# EAGLE design kitteh (EAGLE 5.11)
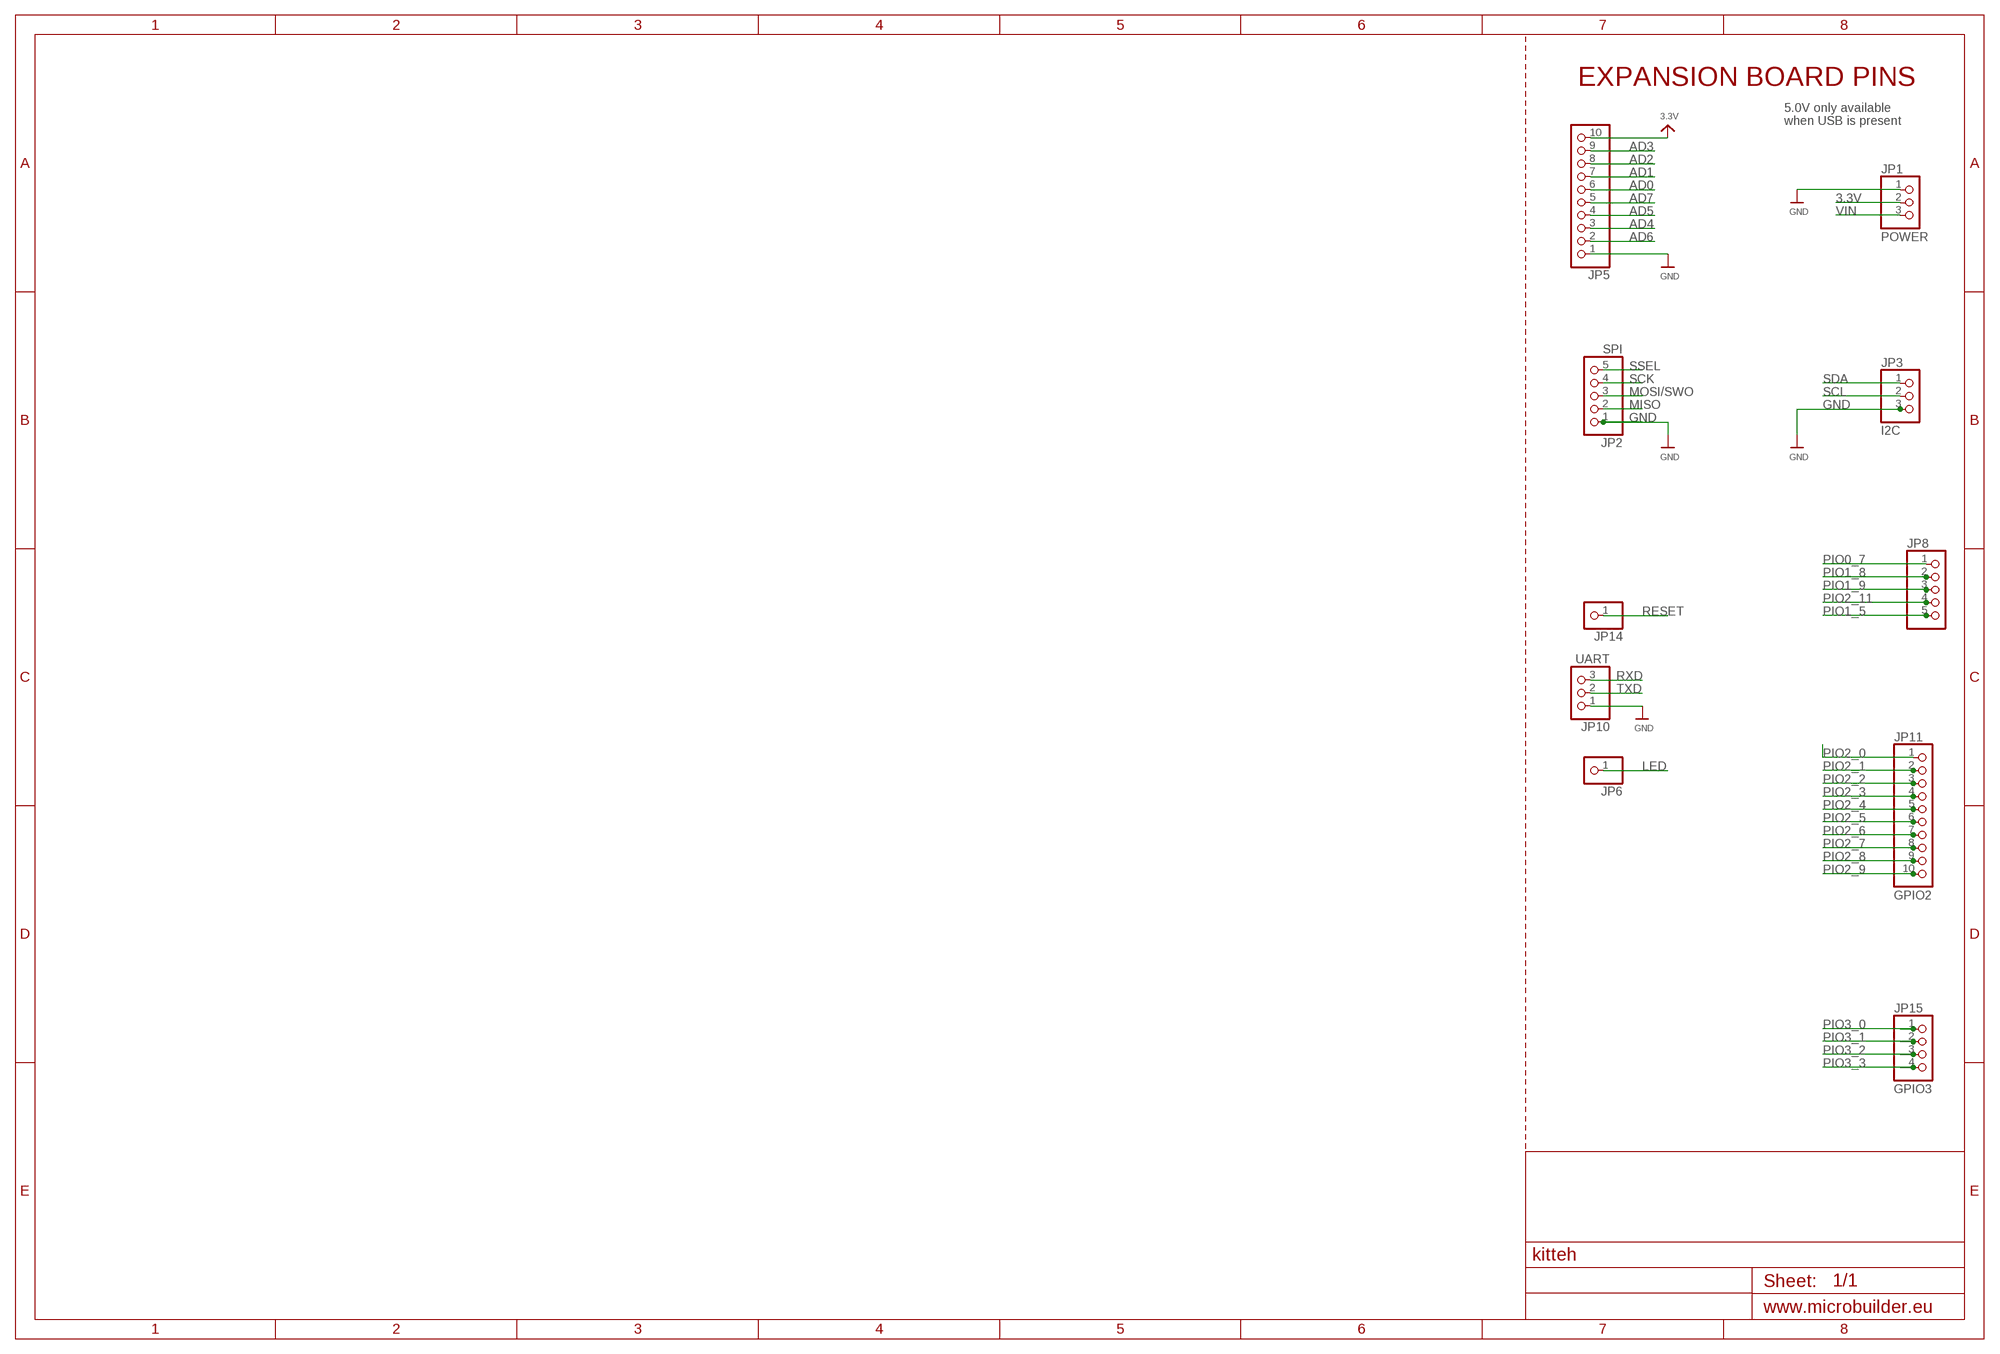
[diagram p0: schematic, sheet 1]

## Parts
JP1  POWER  HEADER-1X3  [1X03_OVAL]
JP2  SPI  HEADER-1X5  [1X05_OVAL]
JP3  I2C  HEADER-1X3  [1X03_OVAL]
JP5  HEADER-1X10  [1X10_OVAL]
JP6  HEADER-1X1  [1X01_OVAL]
JP8  HEADER-1X5  [1X05_OVAL]
JP10  UART  HEADER-1X3  [1X03_OVAL]
JP11  GPIO2  HEADER-1X10  [1X10_OVAL]
JP14  HEADER-1X1  [1X01_OVAL]
JP15  GPIO3  HEADER-1X4  [1X04_OVAL]

## Nets
3.3V: JP1.2 JP5.10
AD0: JP5.6
AD1: JP5.7
AD2: JP5.8
AD3: JP5.9
AD4: JP5.3
AD5: JP5.4
AD6: JP5.2
AD7: JP5.5
GND: JP1.1 JP2.1 JP3.3 JP5.1 JP10.1
LED: JP6.1
MISO: JP2.2
MOSI/SWO: JP2.3
PIO0_7: JP8.1
PIO1_5: JP8.5
PIO1_8: JP8.2
PIO1_9: JP8.3
PIO2_0: JP11.1
PIO2_1: JP11.2
PIO2_2: JP11.3
PIO2_3: JP11.4
PIO2_4: JP11.5
PIO2_5: JP11.6
PIO2_6: JP11.7
PIO2_7: JP11.8
PIO2_8: JP11.9
PIO2_9: JP11.10
PIO2_11: JP8.4
PIO3_0: JP15.1
PIO3_1: JP15.2
PIO3_2: JP15.3
PIO3_3: JP15.4
RESET: JP14.1
RXD: JP10.3
SCK: JP2.4
SCL: JP3.2
SDA: JP3.1
SSEL: JP2.5
TXD: JP10.2
VIN: JP1.3

## Notes on the sheet
- EXPANSION BOARD PINS
- 5.0V only available
- when USB is present

## Library data of the parts
JP1 JP3 JP10 = microbuilder:HEADER-1X3: PIN HEADER
JP2 JP8 = microbuilder:HEADER-1X5: PIN HEADER
JP5 JP11 = microbuilder:HEADER-1X10: PIN HEADER
JP6 JP14 = microbuilder:HEADER-1X1: PIN HEADER
JP15 = microbuilder:HEADER-1X4: PIN HEADER

## Board
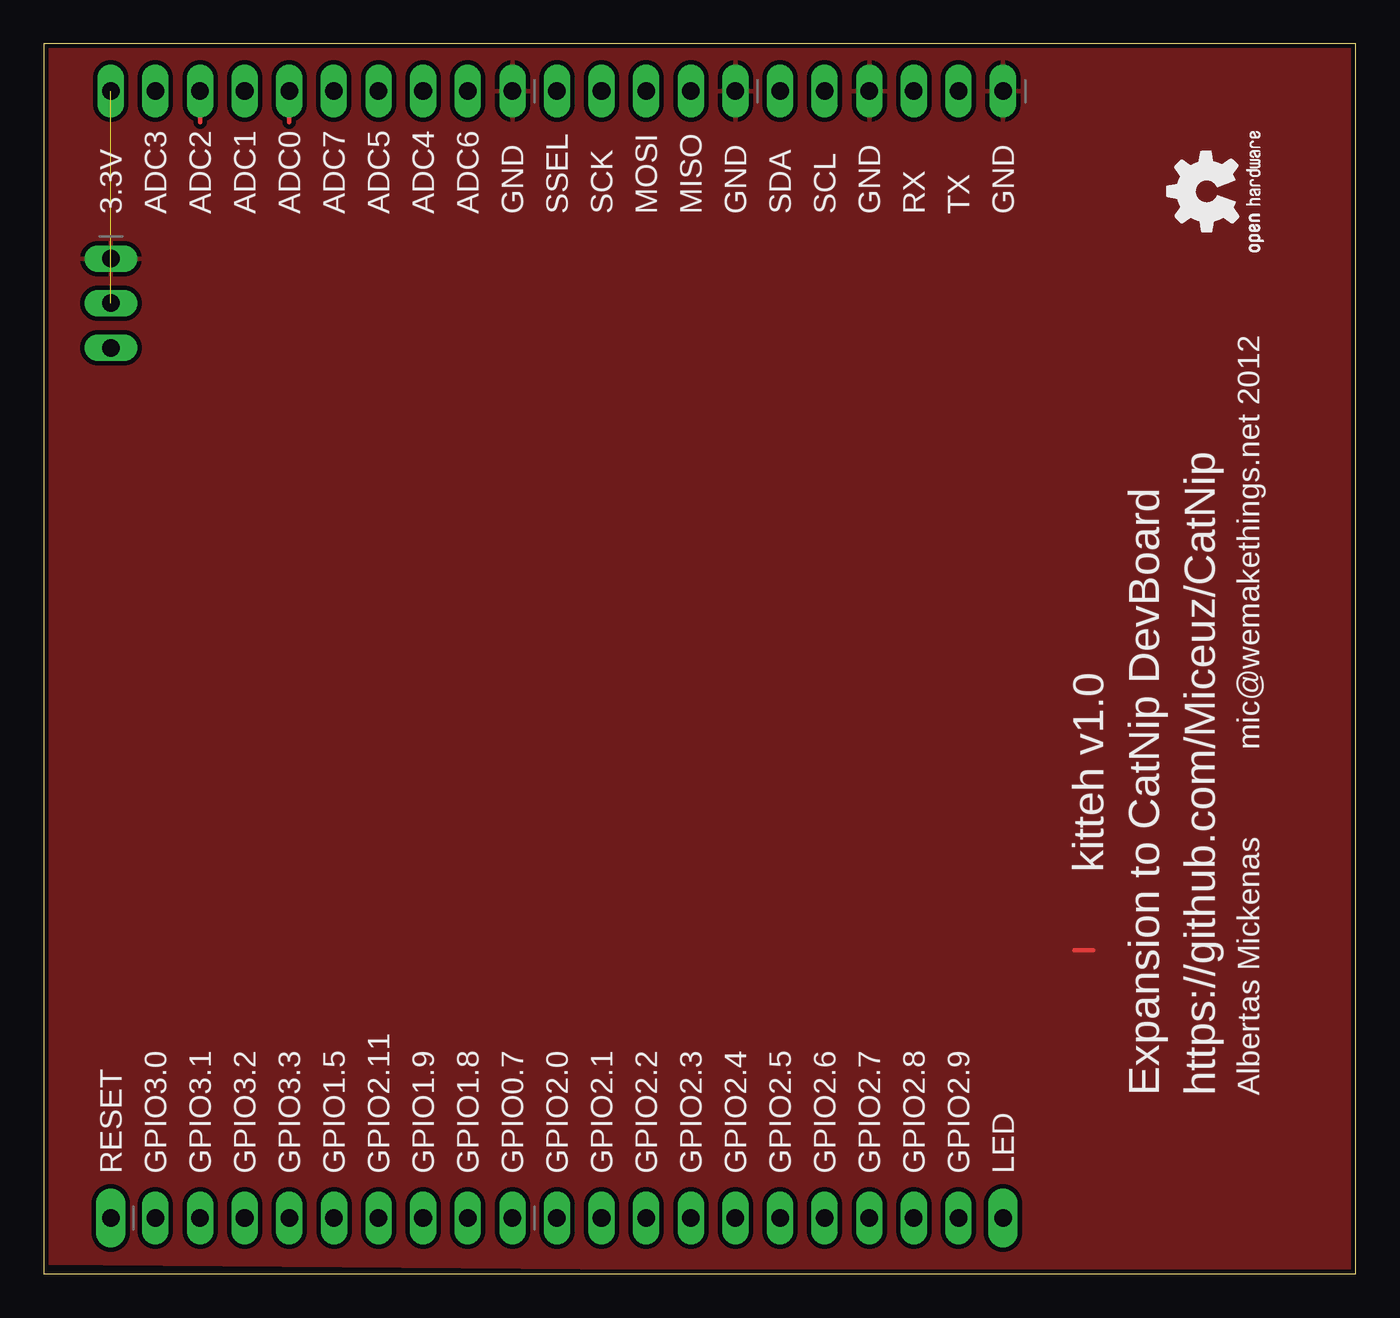
[diagram p1: board, top side]

Size 74.68 x 70 mm. Coordinates in mm from the lower left corner, seen from the top.
Outline: 74.68,0 74.68,70 0,70 0,0 74.68,0
Copper layers (1*16): Top 0.035mm / dielectric 1.5mm / Bottom 0.035mm
Design rules "Fusion_eagle_rule_v1.1": minimum track width 6mil, minimum drill 12mil, track to track 6mil, track to pad 6mil, pad to pad 6mil, via to via 6mil, smd to smd 0mil, copper to edge 10mil, drill to drill 10mil, minimum pad ring 10mil, minimum via ring 6mil, stop-mask expansion 2mil, vias tented up to drill 100mil, thermal gap 10mil
tRestrict: area -16.5,12.1 to -16.4,12.5; area -15.1,12.1 to -15,12.5; area -16.5,18.8 to -16.4,19.3; area -15.1,18.8 to -15,19.3

### Footprints (pad centres in the part's own frame; a part is rotated, then mirrored left to right if it is on the bottom)
1X03_OVAL = drill 1 long: 1 -2.54,0; 2 0,0; 3 2.54,0
1X05_OVAL = drill 1 long: 1 -5.08,0; 2 -2.54,0; 3 0,0; 4 2.54,0; 5 5.08,0
1X10_OVAL = drill 1 long: 1 -11.43,0; 2 -8.89,0; 3 -6.35,0; 4 -3.81,0; 5 -1.27,0; 6 1.27,0; 7 3.81,0; 8 6.35,0; 9 8.89,0; 10 11.43,0
1X01_OVAL = drill 1 pad 1.676 long: 1 0,0
1X04_OVAL = drill 1 long: 1 -3.81,0; 2 -1.27,0; 3 1.27,0; 4 3.81,0

### Placement (x,y rotation side)
JP1  3.81,55.25 270 top
JP2  34.29,67.31 180 top
JP3  44.45,67.31 0 top
JP5  15.24,67.31 180 top
JP6  54.61,3.17 0 top
JP8  21.59,3.17 180 top
JP10  52.07,67.31 180 top
JP11  40.64,3.17 0 top
JP14  3.81,3.18 0 top
JP15  10.16,3.17 0 top
U$16  [OSHW2]  70.49,57.78 90 top

### Tracks (layer width: path | path; a pad name or v marks a point on that pad's centre or on a via)
3.3V  (1 unrouted)
AD0
  Top 0.254: 13.97,65.53 JP5.6
AD2
  Top 0.254: 8.89,65.53 JP5.8
GND
  Top 0.254: 58.68,18.41 59.74,18.41
  pour Top (isolate 0.254): 0,0.64 0.25,69.75 74.68,70 74.68,0
PIO1_9
  Top 0.254: 21.59,3.81 22.23,3.17 JP8.3

### Text on the board
tPlace: 3.3V | ADC3 | ADC2 | ADC1 | ADC0 | ADC7 | ADC5 | ADC4 | ADC6 | GND | SSEL | SCK | MOSI | MISO | GND | SDA | SCL | GND | RX | TX | GND | mic@wemakethings.net 2012 | kitteh v1.0 | Expansion to CatNip DevBoard | https://github.com/Miceuz/CatNip | Albertas Mickenas | RESET | GPIO3.0 | GPIO3.1 | GPIO3.2 | GPIO3.3 | GPIO1.5 | GPIO2.11 | GPIO1.9 | GPIO1.8 | GPIO0.7 | GPIO2.0 | GPIO2.1 | GPIO2.2 | GPIO2.3 | GPIO2.4 | GPIO2.5 | GPIO2.6 | GPIO2.7 | GPIO2.8 | GPIO2.9 | LED